# Altium schematic sheet TankBoardSheet3.SchDoc
size A
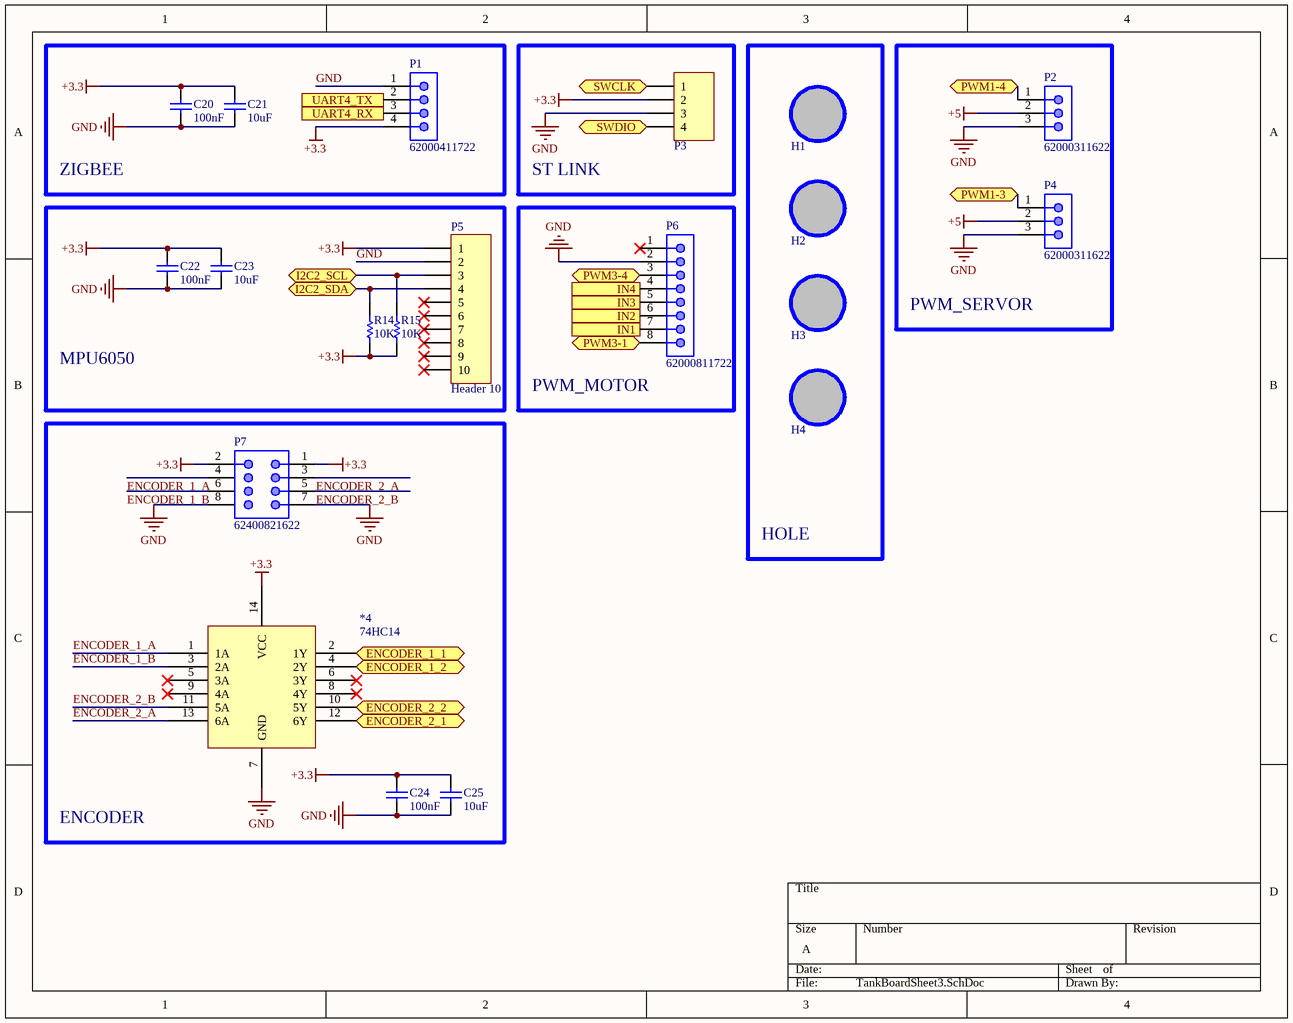
[diagram p0: TankBoardSheet3.SchDoc]

## Parts
*4  74HC14  [SOIC108P600X170-14N]
C20  value 100nF  [CAP-SM-0603]  (hidden comment: Cap Non-Pol SMD)
C21  value 10uF  [CAP-SM-0603]  (hidden comment: Cap Non-Pol SMD)
C22  value 100nF  [CAP-SM-0603]  (hidden comment: Cap Non-Pol SMD)
C23  value 10uF  [CAP-SM-0603]  (hidden comment: Cap Non-Pol SMD)
C24  value 100nF  [CAP-SM-0603]  (hidden comment: Cap Non-Pol SMD)
C25  value 10uF  [CAP-SM-0603]  (hidden comment: Cap Non-Pol SMD)
H1  Hole  [LO KHOAN 3MM]  (value not drawn)
H2  Hole  [LO KHOAN 3MM]  (value not drawn)
H3  Hole  [LO KHOAN 3MM]  (value not drawn)
H4  Hole  [LO KHOAN 3MM]  (value not drawn)
P1  62000411722  [62000411722]
P2  62000311622  [62000311622]
P3  Header 4  [JP4]  (value not drawn)
P4  62000311622  [62000311622]
P5  Header 10  [HDR1X10]
P6  62000811722  [62000811722]
P7  62400821622  [62400821622]
R14  value 10K  [RES-SM-0603]  (hidden comment: RESISTOR SMD)
R15  value 10K  [RES-SM-0603]  (hidden comment: RESISTOR SMD)

## Blocks framed on the sheet
ZIGBEE: C20 C21 P1
ST LINK: P3
HOLE: H1-H4
PWM_SERVOR: P2 P4
MPU6050: C22 C23 P5 R14 R15
PWM_MOTOR: P6
ENCODER: *4 C24 C25 P7

## Ports
ENCODER_1_1 (bidir), ENCODER_1_2 (bidir), ENCODER_2_1 (bidir), ENCODER_2_2 (bidir), I2C2_SCL (bidir), I2C2_SDA (bidir), IN1 (in), IN2 (in), IN3 (in), IN4 (in), PWM1-3 (bidir), PWM1-4 (bidir), PWM3-1 (bidir), PWM3-4 (bidir), SWCLK (bidir), SWDIO (bidir), UART4_RX (out), UART4_TX (in)

## Nets
+3.3: *4.14(VCC) C20.1 C21.1 C22.1 C23.1 C24.1 C25.1 P1.4 P3.2 P5.1 P7.1 P7.2 R14.1 R15.1
+5: P2.2 P4.2
GND: *4.7(GND) C20.2 C21.2 C22.2 C23.2 C24.2 C25.2 P1.1 P2.3 P3.3 P4.3 P5.2 P6.2 P7.7 P7.8
ENCODER_1_1: *4.2(1Y) ; port ENCODER_1_1
ENCODER_1_2: *4.4(2Y) ; port ENCODER_1_2
ENCODER_1_A: *4.1(1A) P7.4
ENCODER_1_B: *4.3(2A) P7.6
ENCODER_2_1: *4.12(6Y) ; port ENCODER_2_1
ENCODER_2_2: *4.10(5Y) ; port ENCODER_2_2
ENCODER_2_A: *4.13(6A) P7.3
ENCODER_2_B: *4.11(5A) P7.5
I2C2_SCL: P5.3 R15.2 ; port I2C2_SCL
I2C2_SDA: P5.4 R14.2 ; port I2C2_SDA
IN1: P6.7 ; port IN1
IN2: P6.6 ; port IN2
IN3: P6.5 ; port IN3
IN4: P6.4 ; port IN4
PWM1-3: P4.1 ; port PWM1-3
PWM1-4: P2.1 ; port PWM1-4
PWM3-1: P6.8 ; port PWM3-1
PWM3-4: P6.3 ; port PWM3-4
SWCLK: P3.1 ; port SWCLK
SWDIO: P3.4 ; port SWDIO
UART4_RX: P1.3 ; port UART4_RX
UART4_TX: P1.2 ; port UART4_TX

Not connected (* = marked no-connect by the designer): *4 5(3A)* 6(3Y)* 8(4Y)* 9(4A)*; H1 1; H2 1; H3 1; H4 1; P5 5* 6* 7* 8* 9* 10*; P6 1*

## Library data of the parts
C20-C25 = Cap Non-Pol SMD: Capacitor
H1-H4 = Hole: Hole 3mm
P1 = 62000411722: WR-WTB THT Male Horizontal Shrouded Header, pitch 2mm, 4p; Pin Number: 4; Contact Resistance: 20mOhm; Rated Current: 2A; Withstanding Voltage: 800VAC; Working Voltage: 125VAC; ComponentLink1Description: Manufacturer; ComponentLink1URL: http://www.we-online.de; ComponentLink2Description: Datasheet; ComponentLink2URL: https://www.we-online.com/catalog/datasheet/62000411722.pdf; Pitch: 2mm; Published Date: January 2020; Publisher: Wurth Elektronik; Mounting Technology: THT; Packaging: Bag; Operating Temperature: -25 to +85degC; Part Number: 62000411722; Gender: Male; Type: Horizontal
P2 P4 = 62000311622: WR-WTB Male Vertical Shrouded Header, pitch 2mm, 3p; Pin Number: 3; Contact Resistance: 20mOhm; Rated Current: 2A; Withstanding Voltage: 800VAC; Working Voltage: 125VAC; ComponentLink1Description: Manufacturer; ComponentLink1URL: http://www.we-online.de; ComponentLink2Description: Datasheet; ComponentLink2URL: https://www.we-online.com/catalog/datasheet/62000311622.pdf; Pitch: 2mm; Published Date: January 2020; Publisher: Wurth Elektronik; Mounting Technology: THT; Packaging: Bag; Operating Temperature: -25 to +85degC; Part Number: 62000311622; Gender: Male; Type: Vertical
P3 = Header 4: Header, 4-Pin; LatestRevisionDate: 17-Jul-2002; LatestRevisionNote: Re-released for DXP Platform.; Publisher: Altium Limited
P5 = Header 10: Header, 10-Pin; LatestRevisionDate: 17-Jul-2002; LatestRevisionNote: Re-released for DXP Platform.; Publisher: Altium Limited
P6 = 62000811722: WR-WTB THT Male Horizontal Shrouded Header, pitch 2mm, 8p; Pin Number: 8; Contact Resistance: 20mOhm; Rated Current: 2A; Withstanding Voltage: 800VAC; Working Voltage: 125VAC; ComponentLink1Description: Manufacturer; ComponentLink1URL: http://www.we-online.de; ComponentLink2Description: Datasheet; ComponentLink2URL: https://www.we-online.com/catalog/datasheet/62000811722.pdf; Pitch: 2mm; Published Date: January 2020; Publisher: Wurth Elektronik; Mounting Technology: THT; Packaging: Bag; Operating Temperature: -25 to +85degC; Part Number: 62000811722; Gender: Male; Type: Horizontal
P7 = 62400821622: WR-WTB THT Male Vertical Shrouded Header with positive locking, Dual Row, pitch 2mm, 8p; Pin Number: 8; Contact Resistance: 20mOhm; Rated Current: 3A; Withstanding Voltage: 1000VAC; Working Voltage: 250VAC; ComponentLink1Description: Manufacturer; ComponentLink1URL: http://www.we-online.de; ComponentLink2Description: Datasheet; ComponentLink2URL: https://www.we-online.com/catalog/datasheet/62400821622.pdf; Pitch: 2mm; Published Date: January 2020; Publisher: Wurth Elektronik; Mounting Technology: THT; Packaging: Tube; Operating Temperature: -25 to +85degC; Part Number: 62400821622; Gender: Male; Type: Vertical
R14 R15 = RESISTOR SMD: Resistor